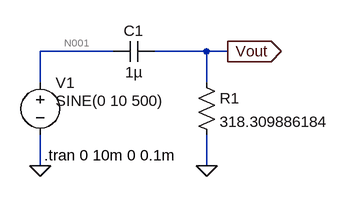
[diagram p0: schematic Draft4.asc]
Draft4.asc, the LTspice schematic file:
Version 4
SHEET 1 880 680
WIRE 112 80 0 80
WIRE 256 80 176 80
WIRE 288 80 256 80
WIRE 0 128 0 80
WIRE 256 128 256 80
WIRE 0 256 0 208
WIRE 256 256 256 208
FLAG 0 256 0
FLAG 256 256 0
FLAG 288 80 Vout
IOPIN 288 80 Out
SYMBOL res 240 112 R0
SYMATTR InstName R1
SYMATTR Value 318.309886184
SYMBOL cap 176 64 R90
WINDOW 0 0 32 VBottom 2
WINDOW 3 32 32 VTop 2
SYMATTR InstName C1
SYMATTR Value 1µ
SYMBOL voltage 0 112 R0
WINDOW 3 24 44 Left 2
WINDOW 123 43 91 Left 2
WINDOW 39 0 0 Left 0
SYMATTR InstName V1
SYMATTR Value SINE(0 10 500)
TEXT 6 240 Left 2 !.tran 0 10m 0 0.1m

The netlist it stands for:
* Draft4.asc
R1 Vout 0 318.309886184
C1 Vout N001 1µ
V1 N001 0 SINE(0 10 500)
.tran 0 10m 0 0.1m
.backanno
.end

* Results of the author's LTspice run, read from the files saved beside the schematic
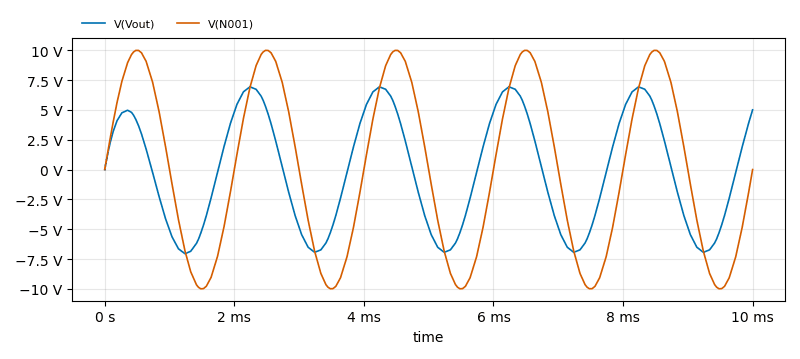
[diagram p1: Transient Analysis of Draft4.asc, plotted from the saved traces]
* Transient Analysis, 1 run:
*   V(Vout): min -7.046 V, max 6.93 V, average -156.9 mV, rms 4.811 V, last 5.001 V
*   V(N001): min -9.986 V, max 9.983 V, average 676.4 µV, rms 7.09 V, last 0 V